# Altium schematic sheet REGENIX_Relais_12V.SchDoc
size Tabloid; Date: Date; Author: Author 1; DocumentNumber: 2; Revision: 1; SheetNumber: 6; SheetTotal: 17; Size: 11x17; Sheet_Name: BATTERY PROTECTION & AUXILIARY
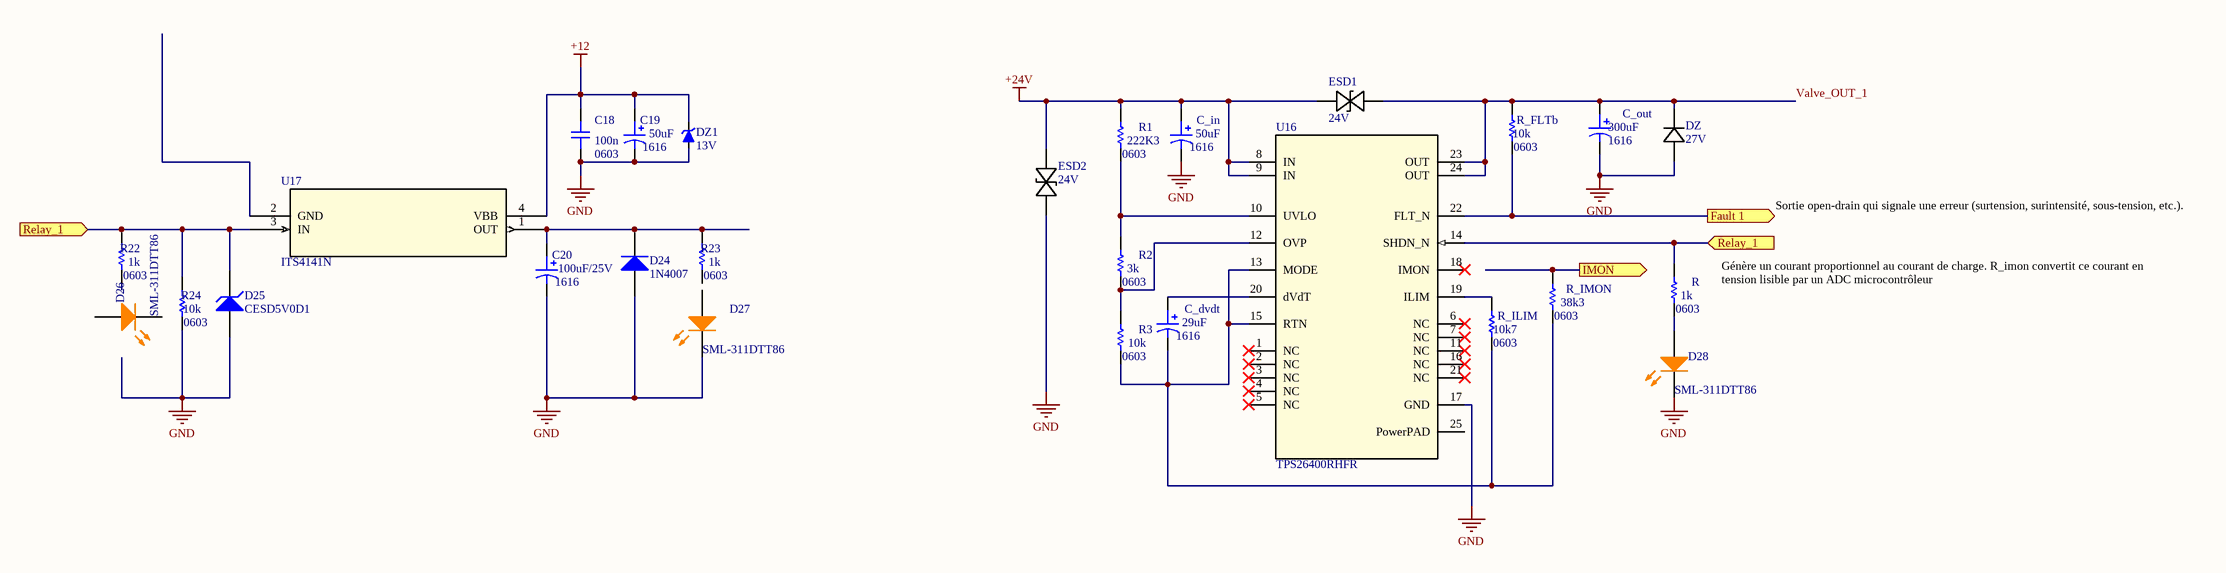
[diagram p0: REGENIX_Relais_12V.SchDoc]

## Parts
C18  Voltage: 100n  Package: 0603  [CAP_0603]  (hidden comment: CAP - 0603)
C19  value 50uF  Package: 1616  [CAP_ALU_1616_vishay]  (hidden comment: MAL214699108E3)
C20  Package: 1616  [CAP_ALU_1616_vishay]  (hidden comment: MAL214699108E3)
C_dvdt  value 29uF  Package: 1616  [CAP_ALU_1616_vishay]  (hidden comment: MAL214699108E3)
C_in  value 50uF  Package: 1616  [CAP_ALU_1616_vishay]  (hidden comment: MAL214699108E3)
C_out  value 300uF  Package: 1616  [CAP_ALU_1616_vishay]  (hidden comment: MAL214699108E3)
D24  1N4007  [FAIR-DO-41-2]
D25  CESD5V0D1  [JSCJ-SOD-123-2_V]
D26  SML-311DTT86  [LED_0603]
D27  SML-311DTT86  [LED_0603]
D28  SML-311DTT86  [LED_0603]
DZ  27V  [SOD123_DIO]
DZ1  Volt: 13V  [SOD-123]  (hidden comment: BZT52C13-TP)
ESD1  24V  [TVS_DFN1006-2_MCC]
ESD2  24V  [TVS_DFN1006-2_MCC]
R  Package: 0603  Precision: 1k  [RES_0603]  (hidden comment: RES - 0603)
R1  Package: 0603  Precision: 222K3  [RES_0603]  (hidden comment: RES - 0603)
R2  Package: 0603  Precision: 3k  [RES_0603]  (hidden comment: RES - 0603)
R3  Package: 0603  Precision: 10k  [RES_0603]  (hidden comment: RES - 0603)
R22  Package: 0603  Precision: 1k  [RES_0603]  (hidden comment: RES - 0603)
R23  Package: 0603  Precision: 1k  [RES_0603]  (hidden comment: RES - 0603)
R24  Package: 0603  Precision: 10k  [RES_0603]  (hidden comment: RES - 0603)
R_FLTb  Package: 0603  Precision: 10k  [RES_0603]  (hidden comment: RES - 0603)
R_ILIM  Package: 0603  1%: 10k7  [RES_0603]  (hidden comment: RES - 0603)
R_IMON  Package: 0603  Precision: 38k3  [RES_0603]  (hidden comment: RES - 0603)
U16  TPS26400RHFR  [RHF0024A-IPC_A]
U17  ITS4141N  [PG-SOT223_INF]

## Ports
Fault 1 (out), IMON (out), Relay_1 (in)

## Nets
+12: C18.2 C19.1 DZ1.2(K) U17.4(VBB)
+24V: C_in.1 ESD1.1(ANODECATHODE) ESD2.1(ANODECATHODE) R1.2 U16.8(IN) U16.9(IN)
GND: C18.1 C19.2 C20.2 C_in.2 C_out.2 D24.2(A) D25.1(A) D27.K D28.K DZ.2 DZ1.1(A) ESD2.2(ANODECATHODE_2) R24.1 U16.17(GND)
Fault 1: R_FLTb.1 U16.22(FLT_N) ; port Fault 1
IMON: R_IMON.2 ; port IMON
Relay_1: D25.2(K) R.2 R22.2 R24.2 U16.14(SHDN_N) U17.3(IN) ; port Relay_1
Valve_OUT_1: C_out.1 DZ.1 ESD1.2(ANODECATHODE_2) R_FLTb.2 U16.23(OUT) U16.24(OUT)
NetC20_1: C20.1 D24.1(K) R23.2 U17.1(OUT)
NetC_dvdt_1: C_dvdt.1 U16.20(dVdT)
NetC_dvdt_2: C_dvdt.2 R3.1 R_ILIM.1 R_IMON.1 U16.13(MODE) U16.15(RTN)
NetD28_A: D28.A R.1
NetR1_1: R1.1 R2.2 U16.10(UVLO)
NetR2_1: R2.1 R3.2 U16.12(OVP)
NetR_ILIM_2: R_ILIM.2 U16.19(ILIM)

Not connected (* = marked no-connect by the designer): D26 A K; D27 A; R22 1; R23 1; U16 1(NC)* 2(NC)* 3(NC)* 4(NC)* 5(NC)* 6(NC)* 7(NC)* 11(NC)* 16(NC)* 18(IMON)* 21(NC)* 25(PowerPAD); U17 2(GND)

## Notes on the sheet
- Sortie open-drain qui signale une erreur (surtension, surintensité, sous-tension, etc.).
  Devient LOW (0V) en cas de défaut.
- (near R) Génère un courant proportionnel au courant de charge. R_imon convertit ce courant en tension lisible par un ADC microcontrôleur
- Sheet Name
- Project Title
- Global Project
- Revision
- Size
- Date
- Group
- Sheet
- of
- Filename
- Designers
- (in symbol CAP_ALU_MAL214699108E3) 100uF/25V

## Library data of the parts
C18 = CAP - 0603: Precision: 10%; Current: *; CreatedBy: Jonathan Bouchard; Power: *
C19 C20 C_dvdt C_in C_out = CAP_ALU_MAL214699108E3: CAP - ALU 470uF 20% 50V - 1616; Current: 1.3A; Mfg: Vishay Dale; Mfg Part Number: MAL214699108E3; HelpURL: http://www.vishay.com/docs/28403/146cti.pdf; CreatedBy: Jonathan Bouchard; Temperature: -55°C to 125°C; Power: *; Supplier 1: Digikey; Supplier Part Number 1: 4442PHCT-ND
D24 = CMP-004-00007-2: General Purpose Rectifier, 1.1 V, 1.0 A, -55 to 175 degC, 2-Pin DO-41, RoHS, Tape and Reel; Manufacturer: Fairchild; Peak Reverse Current: 5uA; Max Surge Current: 30A; Elements: 1; Forward Voltage: 1.1V; Package Version: Rev. 2, 09/2008; Forward Current: 1A; Package Quantity: 5000; Packaging: TapeandReel; Package URL: http://www.fairchildsemi.com/dwg/DO/DO41A.pdf; Manufacturer URL: https://www.fairchildsemi.com/; Package Reference: DO-41-2; Pins: 2; Min Operating Temperature: -55°C; Datasheet Version: Rev. 1.1.0, 11/2014; Max Operating Temperature: 175°C; RoHS Compliant: True; Case/Package: DO-41-2; Mounting Technology: TH; Package Description: 2-Pin Axial Lead, Dia 2.375 mm, Body Length 4.63 mm; Datasheet URL: https://www.fairchildsemi.com/datasheets/1N/1N4007.pdf
D25 = CMP-004-00020-2: Uni-driection ESD Protection Diode, 5 V, 1 uA, 2-Pin SOD-123, RoHS, Tape and Reel; Manufacturer: Jiangsu Changjiang Electronics Technology; Datasheet URL: http://www.cj-elec.com/gallery/txUpfile/f05a5831e2d7f622a930855050fbe076.pdf; Datasheet Version: Rev. B, 04/2014; Package Description: 2-Pin Surface Mount Device, Body 2.7 x 1.6 mm; Package Reference: SOD-123-2; RoHS Compliant: Unknown; Package URL: http://www.cj-elec.com/txUpfile/201412112231195145.pdf; Case/Package: SOD-123-2; Mounting Technology: SM
D26-D28 = LED_SML-311DTT86: LED - 611nM ORANGE 2mA - 0603; Voltage: 1.8V; Mfg: ROHM Semiconductor; Power: 44mW; Current: 2mA; HelpURL: http://media.digikey.com/pdf/Data%20Sheets/Rohm%20PDFs/SML-311%20Series.pdf; CreatedBy: Jonathan Bouchard; Temperature: -40°C to 85°C; Package: 0603; Precision: *; Mfg Part Number: SML-311DTT86; Supplier 1: Digikey; Supplier Part Number 1: 511-1303-1-ND
DZ = MMSZ5254B-7-F: DIODE ZENER 27V 500MW SOD123 MMSZ5254B-7-F; Mfr_Name: Diodes Inc
DZ1 = BZT52C13-TP: Zener Diode 13 V 200 mW ±6% Surface Mount SOD-123; Watt: 200mW; Grade: None; Package / Case: SOD-123; Supplier 1: Digi-Key; Supplier Part Number 1: BZT52C13-TPMSCT-ND; Mounted: Yes; Precision: 6%
ESD1 ESD2 = ESDSBLC24VLB-TP: TVS DIODE 24VWM 36VC 2-DFN1006 ESDSBLC24VLB-TP; Mfr_Name: MCC
U16 = TPS26400RHFR: No Description Available; Mfr_Name: Texas Instruments; TYPE: TYPE; RefDes: RefDes
U17 = ITS4141N: No Description Available; Mfr_Name: Infineon; Digi-Key_Part_Number_4: ITS4141NHUMA1TR-ND; Digi-Key_Part_Number_3: ITS4141NTR-ND; Digi-Key_Part_Number_1: ITS4141NCT-ND; Digi-Key_Part_Number_2: ITS4141NDKR-ND; RefDes: RefDes; Type: Type
R R1-R3 R22-R24 R_FLTb R_ILIM R_IMON = RES - 0603: Current: *; CreatedBy: Jonathan Bouchard